# EasyEDA Pro project PCB.epro

# Board PCB1
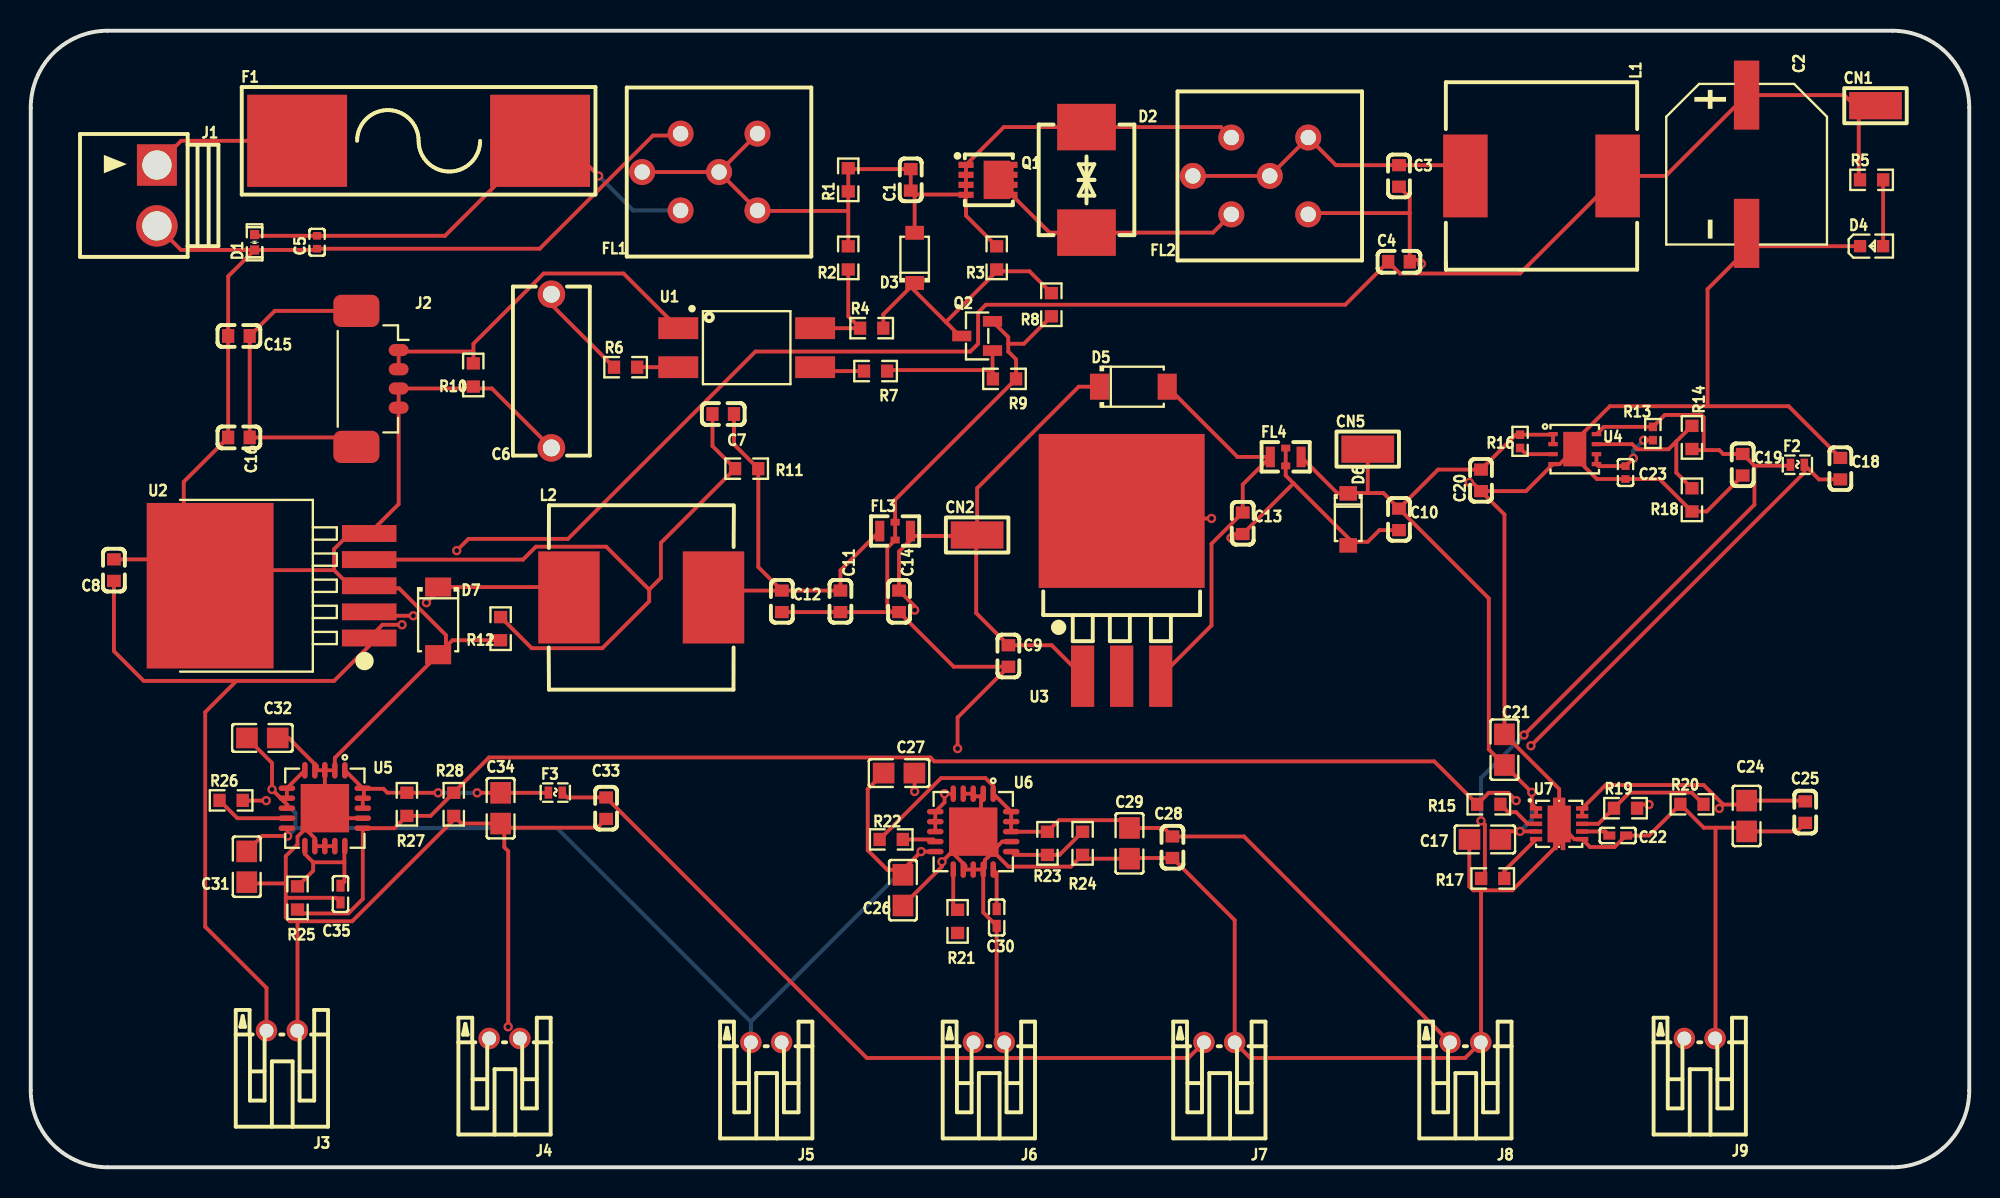
[diagram p0: board, top side]
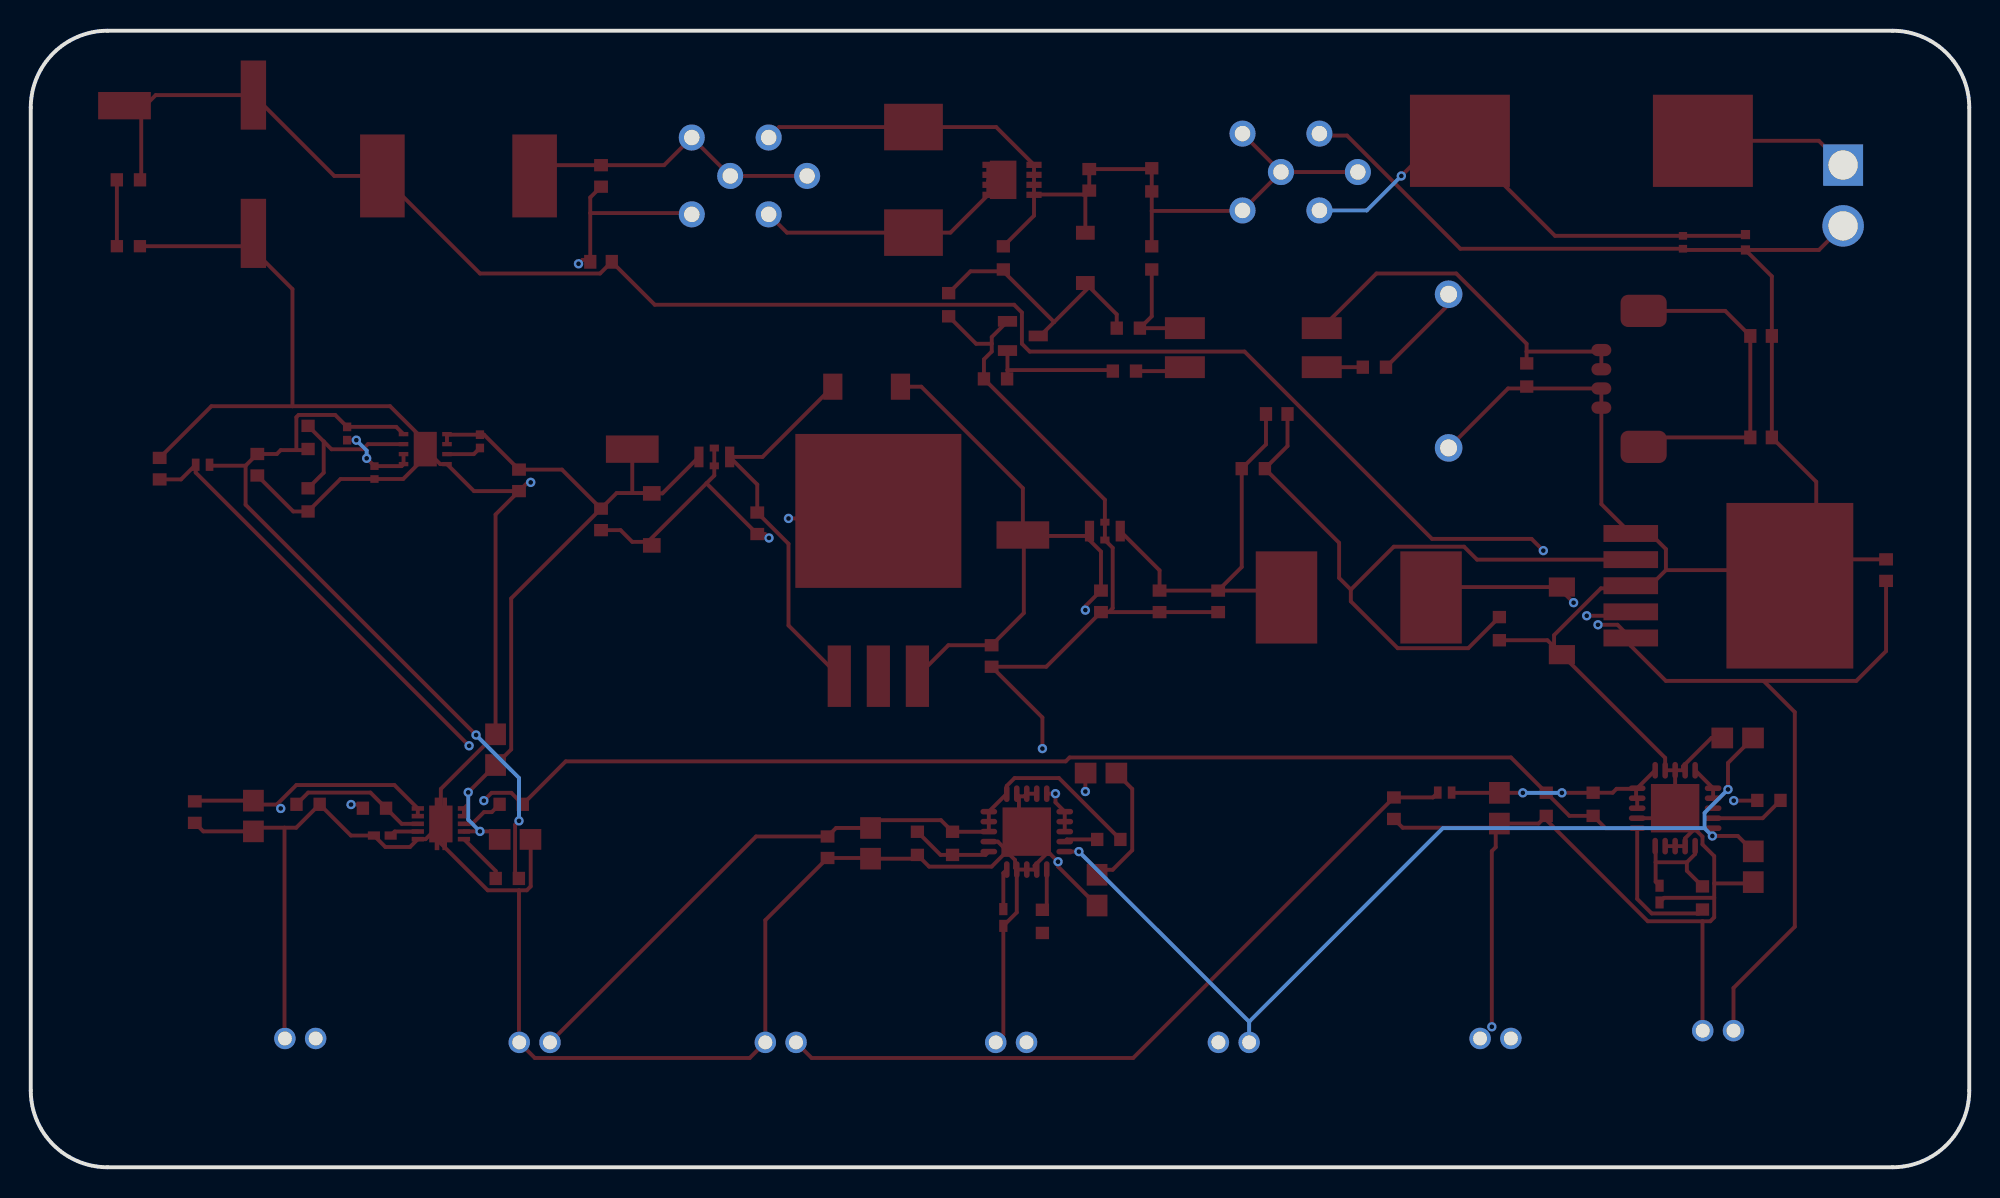
[diagram p1: board, bottom side, seen from below]

Outline 126.06 x 73.97 mm; copper layers: Top Layer, Inner1, Inner2, Bottom Layer. Coordinates in mm from the lower left corner of the outline.
Outline path: 0,68.97 arc(1.46,72.5) 5,73.97 121.06,73.97 arc(124.59,72.5) 126.06,68.97 126.06,5 arc(124.59,1.46) 121.06,0 5,0 arc(1.46,1.46) 0,5 0,68.97
Stack: Top Layer 0.035mm Outer layer thickness 1oz / Dielectric1 0.2104mm 7628 RC49% 8.6mil / Inner1 0.0152mm Inner layer thickness / Dielectric2 1.065mm 1.1mm H/HOZ Copper / Inner2 0.0152mm Inner layer thickness / Dielectric3 0.2104mm 7628 RC49% 8.6mil / Bottom Layer 0.035mm Outer layer thickness 1oz

## Design rules (mm)
template: JLCPCB Capability(Two Layers Board)
spacing copperThickness1oz (default): track to track 0.102, other pairs 0.152 to 0.3
spacing copperThickness2oz: track to track 0.203, other pairs 0.152 to 0.3
track width copperThickness1oz (default): min 0.127, default 0.254, max 2.54
track width copperThickness2oz: min 0.203, default 0.254, max 2.54
differential pair differentialPair (default): width min 0.127, default 0.254, max 2.54; gap min 0.152, default 0.152
via viaSize (default): diameter min 0.5, default 0.61, max 10; hole min 0.3, default 0.305, max 6.3

## Placement (name value [footprint] x y rotation side)
C1  1uF/50V  [C0603]  57.23 64.26 90 top
C2  330 µF/25V  [CAP-SMD_BD10.0-L10.3-W10.3-FD]  111.58 65.28 270 top
C3  10µF  [C0603]  88.98 64.52 270 top
C4  10µF  [C0603]  88.98 58.93 0 top
C5  1uF / 50V  [C0402#2]  18.62 60.2 90 top
C6  4700pF/440VAC  [CAP-TH_L11.0-W5.0-P10.00-D0.7]  33.86 51.82 90 top
C7  DNP  [C0603]  45.03 49.02 180 top
C8  10µF  [C0603]  5.41 38.86 90 top
C9  0.33µF/50V  [C0603]  63.58 33.27 270 top
C10  100uF/35V  [C0603]  88.98 42.16 270 top
C11  0.22µF/50V  [C0603]  52.65 36.83 270 top
C12  10uF/25V  [C0603]  48.84 36.83 270 top
C13  100nF  [C0603]  78.82 41.91 270 top
C14  100uF/35V  [C0603]  56.46 36.83 270 top
C15  4700pF/440VAC  [C0603]  13.54 54.1 180 top
C16  4700pF/440VAC  [C0603]  13.54 47.5 180 top
C17  22uF/16V  [C0805]  94.56 21.34 180 top
C18  4.7uF/10V  [C0603]  117.68 45.47 270 top
C19  10µF/25V  [C0603]  111.33 45.72 270 top
C20  4.7uF/10V  [C0603]  94.31 44.7 90 top
C21  22uF/16V  [C0805]  95.83 27.18 270 top
C22  DNP  [C0402]  103.2 21.59 180 top
C23  1nF/50V  [C0402#2]  103.71 45.21 90 top
C24  22uF/16V  [C0805]  111.58 22.86 90 top
C25  4.7uF  [C0603]  115.39 23.11 270 top
C26  22uF/16V  [C0805]  56.72 18.03 90 top
C27  22uF/16V  [C0805]  56.46 25.65 180 top
C28  4.7uF/10V  [C0603]  74.24 20.83 270 top
C29  22uF/16V  [C0805]  71.45 21.08 90 top
C30  0.1uF/10V  [C0402]  62.81 16.26 90 top
C31  22uF/16V  [C0805]  14.05 19.56 90 top
C32  22uF/16V  [C0805]  15.06 27.94 180 top
C33  4.7uF/10V  [C0603]  37.41 23.37 270 top
C34  22uF/16V  [C0805]  30.56 23.37 90 top
C35  0.1uF/10V  [C0402]  20.14 17.78 90 top
CN1  TP1  [CONN-SMD_5017]  119.96 69.09 0 top
CN2  TP2  [CONN-SMD_5017]  61.54 41.15 0 top
CN5  TP3  [CONN-SMD_5017]  86.94 46.74 0 top
D1  12V / 75.4 A  [D0402-BI]  14.55 60.2 90 top
D2  12V / 75.4 A  [SMC_L6.9-W5.9-LS7.9-BI]  68.66 64.26 270 top
D3  6V/10mA  [SOD-123_L2.7-W1.6-LS3.7-RD]  57.48 59.18 90 top
D4  GREEN_LED  [LED0603-RD]  119.71 59.94 0 top
D5  40V/3A  [SOD-128_L3.7-W2.5-LS4.7-RD]  71.7 50.8 0 top
D6  DNP  [SOD-123_L2.8-W1.8-LS3.7-RD]  85.67 42.16 270 top
D7  40V/3A  [SOD-128_L3.7-W2.5-LS4.7-RD]  26.49 35.56 270 top
F1  32 VAC/2A  [FUSE-SMD_L20.0-W5.2]  25.22 66.8 0 top
F2  32V/2A  [F0402]  114.88 45.72 0 top
F3  32V/2A  [F0402]  34.11 24.38 0 top
FL1  25V/15A  [FILTER-TH_6P-L12.0-W11.0_BNX016-01]  43.51 64.77 90 top
FL2  25V/15A  [FILTER-TH_6P-L12.0-W11.0_BNX016-01]  79.32 64.52 90 top
FL3  1 µF/16V  [FILTER-SMD_3P-L2.0-W1.2-L]  56.21 41.4 0 top
FL4  1 µF/16V  [FILTER-SMD_3P-L2.0-W1.2-L]  81.61 46.23 0 top
J1  2POS/10A  [CONN-TH_2P-P3.96-V]  8.2 63.25 270 top
J2  -  [antmicro-footprints:Conn_Molex_PicoBlade_1x4_0533980471]  22.17 51.31 270 top
J3  2POS/2A  [CONN-TH_S2B-PH-K-S-GW]  16.33 8.89 180 top
J4  2POS/2A  [CONN-TH_S2B-PH-K-S-GW]  30.81 8.38 180 top
J5  2POS/2A  [CONN-TH_S2B-PH-K-S-GW]  47.83 8.13 180 top
J6  2POS/2A  [CONN-TH_S2B-PH-K-S-GW]  62.3 8.13 180 top
J7  2POS/2A  [CONN-TH_S2B-PH-K-S-GW]  77.29 8.13 180 top
J8  2POS/2A  [CONN-TH_S2B-PH-K-S-GW]  93.29 8.13 180 top
J9  2POS/2A  [CONN-TH_S2B-PH-K-S-GW]  108.53 8.38 180 top
L1  22uH  [7447709220]  93.29 64.52 270 top
L2  33µH/4.2A  [IND-SMD_L12.0-W12.0-A]  39.7 37.08 0 top
Q1  30 V/35 A  [POWERPAK-1212-8_L3.0-W3.0-P0.65-LS3.3-BL]  62.3 64.26 270 top
Q2  350V/0.5A  [SOT-23-3_L2.9-W1.3-P1.90-LS2.4-BR]  61.54 54.1 0 top
R1  100kΩ  [R0603]  53.16 64.26 90 top
R2  0E  [R0603]  53.16 59.18 90 top
R3  100k  [R0603]  62.81 59.18 90 top
R4  DNP  [R0603]  54.69 54.61 0 top
R5  1K  [R0603]  119.71 64.26 0 top
R6  649E  [R0603]  38.68 52.07 0 top
R7  330E  [R0603]  54.94 51.82 180 top
R8  DNP  [R0603]  66.37 56.13 90 top
R9  10K  [R0603]  63.32 51.31 180 top
R10  DNP  [R0603]  28.78 51.56 90 top
R11  5.6K  [R0603]  46.56 45.47 0 top
R12  1.2K  [R0603]  30.56 35.05 90 top
R13  100K  [R0402]  105.48 47.75 90 top
R14  145k  [R0603]  108.02 47.5 270 top
R15  10K  [R0603]  94.82 23.62 180 top
R16  100K  [R0402]  96.85 47.24 270 top
R17  0E  [R0603]  95.07 18.8 0 top
R18  20k  [R0603]  108.02 43.43 90 top
R19  2.49K  [R0603]  103.71 23.37 0 top
R20  4.99K  [R0603]  108.02 23.62 0 top
R21  0E  [R0603]  60.27 16 270 top
R22  10K  [R0603]  55.95 21.34 180 top
R23  3.57K  [R0603]  66.11 21.08 90 top
R24  1.69K  [R0603]  68.4 21.08 90 top
R25  0E  [R0603]  17.35 17.53 270 top
R26  10K  [R0603]  13.03 23.88 0 top
R27  3.57K  [R0603]  24.46 23.62 90 top
R28  1.69K  [R0603]  27.51 23.62 90 top
U1  80V/ 50mA  [SOP-4_L6.5-W4.6-P2.54-LS10.3-TL]  46.56 53.34 0 top
U2  7V/3A  [TO-263-5_L10.4-W8.6-P1.70-LS15.3-BR]  16.84 37.85 0 top
U3  UA7805CKTTR  [TO-263-3_L10.2-W9.0-P2.54-LS15.2-TL]  70.94 37.34 90 top
U4  MCP1727T-ADJE/MF  [DFN-8_L3.0-W3.0-P0.65-BL-EP]  100.41 46.74 270 top
U5  TPS74801RGWR  [VQFN-20_L5.0-W5.0-P0.65-TL-EP]  19.12 23.37 270 top
U6  TPS74801RGWR  [VQFN-20_L5.0-W5.0-P0.65-TL-EP]  61.29 21.84 270 top
U7  TPS74801DRCR  [VSON-10_L3.0-W3.0-P0.50-TL-EP]  99.39 22.35 0 top

## Footprints (pads in the part's own frame, mm; a bottom-side part is the same pattern mirrored in y, then rotated)
7447709220
  rect 5.4x2.9 smd: 1(0,0) 2(0,9.9)
antmicro-footprints:Conn_Molex_PicoBlade_1x4_0533980471
  rrect 0.8x1.3 smd: 1(-1.875,1.75) 2(-0.625,1.75) 3(0.623,1.75) 4(1.874,1.75)
  rrect 2.1x3 smd: MP1(-4.425,-0.998) MP2(4.424,-0.998)
C0402
  rect 0.79x0.54 smd: 1(-0.545,0) 2(0.545,0)
C0402#2
  rect 0.5x0.54 smd: 1(-0.42,0) 2(0.42,0)
C0603
  rect 0.8x0.9 smd: 1(-0.7,0) 2(0.7,0)
C0805
  rect 1.41x1.35 smd: 1(-1,0) 2(1,0)
CAP-SMD_BD10.0-L10.3-W10.3-FD
  rect 4.5x1.65 smd: 1(-4.5,0) 2(4.5,0)
CAP-TH_L11.0-W5.0-P10.00-D0.7
  round 1.8 hole 1.1: 1(-5,0) 2(5,0)
CONN-SMD_5017
  rect 3.43x1.78 smd: 1(0,0)
CONN-TH_2P-P3.96-V
  rect 2.7x2.6 hole 1.9: 1(-1.98,0)
  round 2.7 hole 1.9: 2(1.98,0)
CONN-TH_S2B-PH-K-S-GW
  round 1.4 hole 0.9: 1(1,0) 2(-1,0)
D0402-BI
  rect 0.6x0.6 smd: 1(-0.5,0) 2(0.5,0)
DFN-8_L3.0-W3.0-P0.65-BL-EP
  rect 0.28x0.625 smd: 1(-0.975,-1.413) 2(-0.325,-1.413) 3(0.325,-1.413) 4(0.975,-1.413) 5(0.975,1.413) 6(0.325,1.413) 7(-0.325,1.413) 8(-0.975,1.413)
  rect 2.25x1.5 smd: 9(0,0)
F0402
  rect 0.5x0.8 smd: 1(-0.45,0) 2(0.45,0)
FILTER-SMD_3P-L2.0-W1.2-L
  rect 0.6x1.35 smd: 1(-1,0) 3(1,0)
  rect 0.6x0.45 smd: 2(0,0.58) 2(0,-0.58)
FILTER-TH_6P-L12.0-W11.0_BNX016-01
  round 1.7 hole 1: 1(-2.5,1.25) 2(2.5,1.25) 3(-2.5,-3.75) 4(0,3.75) 4(0,-1.25) 4(2.5,-3.75)
FUSE-SMD_L20.0-W5.2
  rect 6.5x6 smd: 1(-7.9,0) 2(7.9,0)
IND-SMD_L12.0-W12.0-A
  rect 4x6 smd: 1(-4.7,0) 2(4.7,0)
LED0603-RD
  rect 0.8x0.8 smd: 1(-0.749,0) 2(0.749,0)
POWERPAK-1212-8_L3.0-W3.0-P0.65-LS3.3-BL
  rect 0.406x0.991 smd: 1(-0.975,-1.486) 2(-0.325,-1.486) 3(0.325,-1.486) 4(0.975,-1.486)
  rect 0.406x0.762 smd: 5(0.975,1.486) 6(0.325,1.486) 7(-0.325,1.486) 8(-0.975,1.486)
  rect 2.5x1.727 smd: 8(0,0.52)
R0402
  rect 0.566x0.54 smd: 1(-0.433,0) 2(0.433,0)
R0603
  rect 0.806x0.864 smd: 1(-0.753,0) 2(0.753,0)
SMC_L6.9-W5.9-LS7.9-BI
  rect 3.03x3.82 smd: 1(-3.435,0) 2(3.435,0)
SOD-123_L2.7-W1.6-LS3.7-RD
  rect 0.91x1.22 smd: 1(-1.635,0) 2(1.635,0)
SOD-123_L2.8-W1.8-LS3.7-RD
  rect 0.95x1.15 smd: 1(-1.692,0) 2(1.692,0)
SOD-128_L3.7-W2.5-LS4.7-RD
  rect 1.25x1.7 smd: 1(-2.2,0) 2(2.2,0)
SOP-4_L6.5-W4.6-P2.54-LS10.3-TL
  rect 2.6x1.423 smd: 1(-4.45,1.27) 2(-4.45,-1.27) 3(4.45,-1.27) 4(4.45,1.27)
SOT-23-3_L2.9-W1.3-P1.90-LS2.4-BR
  rect 1.25x0.7 smd: 1(1,-0.95) 2(1,0.95) 3(-1,0)
TO-263-3_L10.2-W9.0-P2.54-LS15.2-TL
  rect 4x1.511 smd: 1(-5.378,2.54) 2(-5.378,0) 3(-5.378,-2.54)
  rect 10.02x10.8 smd: 4(5.378,0)
TO-263-5_L10.4-W8.6-P1.70-LS15.3-BR
  rect 3.552x1.102 smd: 1(5.173,-3.4) 2(5.173,-1.7) 3(5.173,0) 4(5.173,1.7) 5(5.173,3.4)
  rect 8.251x10.777 smd: 6(-5.173,0)
VQFN-20_L5.0-W5.0-P0.65-TL-EP
  oval 1.087x0.364 smd: 1(-2.469,1.3) 2(-2.469,0.649) 3(-2.469,-0.001) 4(-2.469,-0.65) 5(-2.469,-1.3) 11(2.469,-1.3) 12(2.469,-0.65) 13(2.469,-0.001) 14(2.469,0.649) 15(2.469,1.3)
  oval 0.364x1.087 smd: 6(-1.3,-2.469) 7(-0.65,-2.469) 8(0,-2.469) 9(0.65,-2.469) 10(1.3,-2.469) 16(1.3,2.468) 17(0.65,2.468) 18(0,2.468) 19(-0.65,2.468) 20(-1.3,2.468)
  rect 3.15x3.15 smd: 21(0,0.001)
VSON-10_L3.0-W3.0-P0.50-TL-EP
  rect 0.8x0.3 smd: 1(-1.5,1) 2(-1.5,0.5) 3(-1.5,0) 4(-1.5,-0.5) 5(-1.5,-1) 6(1.5,-1) 7(1.5,-0.5) 8(1.5,0) 9(1.5,0.5) 10(1.5,1)
  custom 1.52x3.42 smd: 11(0.002,-0.009)

## Nets
GND: C2.2 C3.2 C4.2 C5.1 C6.1 C8.2 C9.2 C11.2 C12.2 C14.2 C15.2 C16.2 C17.2 C18.1 C19.2 C20.1 C21.1 C22.1 C23.1 C24.1 C25.2 C26.1 C27.1 C28.2 C29.1 C30.1 C31.1 C32.1 C33.2 C34.1 C35.1 D1.1 D4.1 D7.2 FL1.2 FL2.3 FL3.2 J1.2 J2.3 J2.4 J3.2 J4.2 J5.2 J6.2 J7.2 J8.2 J9.2 Q2.2 R8.1 R9.1 R10.1 R12.1 R18.1 R20.1 R24.1 R28.1 U2.3 U2.5 U2.6 U4.4 U4.9 U5.2 U5.3 U5.4 U5.12 U5.13 U5.14 U5.17 U5.21 U6.2 U6.3 U6.4 U6.12 U6.13 U6.14 U6.17 U6.21 U7.6 U7.11
PGND: C6.2 R6.1
VCC_1.2: R21.2
VCC_1.2V: C24.2 C25.1 J9.1 R15.2 R19.2 R25.2 R27.1 R28.2 U5.16 U7.9 U7.10
VCC_1.8V: C28.1 C29.2 J8.1 R22.2 R23.2 U6.1 U6.18 U6.19 U6.20
VCC_2.5V: C33.1 F3.2 J7.1
VCC_3.3V: C19.1 F2.1 R13.2 R14.2 R17.1 U4.8
VCC_3V3: C18.2 F2.2 J6.1
VCC_5V: C10.1 C17.1 C20.2 C21.2 C26.2 C27.2 C31.2 C32.2 CN5.1 D6.1 FL4.3 J5.1 R16.1 U4.1 U4.2 U5.5 U5.6 U5.7 U5.8 U5.10 U6.5 U6.6 U6.7 U6.8 U6.10 U7.1 U7.2 U7.4
VCC_7V: C9.1 C14.1 CN2.1 D5.1 FL3.3 J4.1 U3.1
VCC_12V: C2.1 C4.1 C8.1 CN1.1 J3.1 L1.2 R5.1 U2.1
ISO_GND: C15.1 C16.1 J2.MP1 J2.MP2
$1N2038: F1.1 J1.1
$1N2042: C5.2 D1.2 F1.2 FL1.1
$1N3566: D2.2 FL2.1 Q1.5 Q1.6 Q1.7 Q1.8
$1N3860: C1.1 C1.2 D2.1 D3.2 FL1.3 FL1.4 FL2.2 Q1.1 Q1.2 Q1.3 Q1.4 R1.1 R1.2 R2.2 R3.2
$1N4246: R2.1 R4.1 U1.4
$1N4254: D3.1 Q2.3 R3.1 R4.2 R8.2
$1N4474: Q2.1 R7.1 R9.2
$1N4599: R7.2 U1.3
$1N4786: J2.1 J2.2 R10.2 U1.1
$1N5255: C3.1 FL2.4 L1.1
$1N6567: D4.2 R5.2
$1N7484: R6.2 U1.2
$1N22535: D7.1 L2.1 U2.2
$1N22536: C7.1 C11.1 C12.1 FL3.1 L2.2 R11.2
$1N22537: C7.2 R11.1 R12.2 U2.4
$1N24363: C10.2 C13.2 D6.2 FL4.2 U3.4
$1N24388: C13.1 D5.2 FL4.1 U3.3
$1N24953: R16.2 U4.3
$1N24955: C23.2 R13.1 U4.5 U4.6
$1N24959: R14.1 R18.2 U4.7
$1N26860: R22.1 U6.9
$1N26933: R23.1 R24.2 U6.16
$1N27469: C35.2 R25.1 U5.11 U5.15
$1N27471: R26.1 U5.9
$1N28104: R17.2 U7.5
$1N28105: C22.2 U7.7
$1N28110: R15.1 U7.3
$1N28114: R19.1 R20.2 U7.8
$1N30982: C34.2 F3.1 R26.2 R27.2 U5.1 U5.18 U5.19 U5.20
$1N43010: C30.2 U6.15
$1N43072: R21.1 U6.11

Pads without a net: U3 2

## Via types
v1: diameter 0.61, hole 0.305, Top Layer to Bottom Layer, 31 vias

## Routing (per net, layer and track width the routed paths; a pad name or vN(x,y) marks a point on that pad's centre or on a via; arc(x,y) is an arc through that point)
GND: length 530.9
  Top Layer w0.254: 109.04,49.53 102.69,49.53 100.41,47.24 U4.9 ; 109.04,49.53 114.31,49.53 C18.1 ; 109.04,49.53 109.04,57.15 111.58,59.69 111.58,59.94 ; U4.9 99.43,45.76 U4.4 97.24,44 C20.1 ; U4.9 100.41,46.23 101.84,44.79 C23.1 105.91,44.79 R18.1 108.99,42.68 C19.2 ; 61.8,21.85 61.3,21.85 U6.21 ; 61.8,21.85 61.8,24.14 ; 61.8,21.85 62.81,20.84 ; 55.95,36.13 C11.2 C12.2 ; 55.95,36.13 C14.2 60.02,32.57 C9.2 60.27,29.27 v1(60.27,27.25) ; 55.95,36.13 55.7,36.38 55.7,40.31 FL3.2 FL3.2 56.21,43.44 R9.1 64.07,52.58 63.57,53.09 63.57,53.59 ; 30.79,22.1 36.84,22.1 C33.2 ; 30.79,22.1 30.79,20.83 31.05,20.57 v1(31.05,9.14) ; 30.79,22.1 C34.1 28.01,22.37 R28.1 27.51,22.61 20.9,16.01 17.35,16.01 ; 16.59,18.47 14.13,18.47 C31.1 ; 16.59,18.47 16.59,17.53 ; 16.59,18.47 16.59,20.25 17.35,21.01 17.35,21.52 17.86,22.03 ; C3.2 89.67,63.12 89.67,62.1 ; 89.67,62.1 89.67,59.05 ; 89.67,62.1 83.16,62.1 FL2.3 ; 18.62,25.84 18.62,26.09 16.77,27.94 C32.1 ; 18.62,25.84 U5.4 ; 18.62,25.84 U5.3 ; 16.59,17.53 16.59,16.26 16.84,16.01 17.35,16.01 ; 16.59,17.53 19.84,17.53 20.14,17.23 ; 28.75,50.68 29.99,50.68 C6.1 ; 28.75,50.68 28.75,50.78 R10.1 ; 28.75,50.68 J2.3 J2.4 23.92,43.16 U2.5 20.74,41.25 19.73,40.23 19.73,38.86 ; J3.2 17.35,8.91 17.35,16.01 ; J9.2 109.56,8.41 109.56,22.1 ; R8.1 64.58,53.59 63.57,53.59 ; 27,33.87 D7.2 19.77,26.64 U5.2 U5.3 ; 27,33.87 27,34.63 23.95,37.68 22.18,37.68 U2.3 20.74,37.85 19.73,38.86 ; 27,33.87 27.43,34.3 R12.1 ; 9.95,39.56 C8.2 ; 9.95,39.56 U2.6 12.68,38.86 19.73,38.86 ; 9.95,39.56 9.95,44.61 C16.2 C15.2 12.84,57.98 D1.1 ; 62.81,20.33 62.81,20.84 ; 62.81,20.33 62.38,20.33 62.05,20 62.05,19.49 U6.14 ; 62.81,20.33 63.58,19.57 67.64,19.57 R24.1 68.65,20.08 C29.1 71.49,20.13 C28.2 78.29,16.08 J7.2 79.31,7.11 93.28,7.11 J8.2 94.31,8.15 94.31,18.02 ; 62.81,20.84 63.17,21.19 U6.17 ; D1.1 9.77,59.7 J1.2 ; D1.1 18.54,59.7 C5.1 33.09,59.78 40.46,67.14 42.13,67.14 FL1.2 ; J6.2 62.81,8.62 62.81,15.71 61.94,16.58 U6.14 ; 63.57,53.59 63.57,54.03 Q2.2 ; 89.67,59.05 90.18,59.05 v1(90.44,58.8) ; 89.67,59.05 C4.2 ; 19.05,22.72 18.55,22.72 17.86,22.03 ; 19.05,22.72 U5.17 ; 19.05,22.72 19.05,23.3 U5.21 U5.3 ; 61.8,24.14 61.46,24.14 U6.3 U6.4 ; 61.8,24.14 U6.2 ; C20.1 95.83,42.48 C21.1 99.39,24.62 U7.11 99.9,21.83 ; C20.1 93.74,44.57 v1(93.55,44.57) ; U5.14 U5.13 U5.12 18.48,21.41 17.86,22.03 ; 109.56,22.1 108.8,22.1 R20.1 105.24,21.59 103.74,21.59 103,20.84 101.4,20.84 U7.6 100.38,21.35 99.9,21.83 ; 109.56,22.1 111.34,22.1 C24.1 114.84,21.86 C25.2 ; 60.78,19.37 U6.13 U6.14 ; 60.78,19.37 60.78,19.63 60.02,20.39 59.76,20.39 v1(59.26,19.88) 59.26,19.57 C26.1 ; 60.78,19.37 U6.12 ; 111.58,59.94 C2.2 ; 111.58,59.94 D4.1 ; C17.2 93.55,21.32 93.55,18.28 93.8,18.02 94.31,18.02 ; 94.31,18.02 96.34,18.02 99.9,21.58 99.9,21.83 ; C27.1 57.48,25.64 v1(57.48,24.45)
  Inner1 w0.254: v1(57.48,24.45) v1(60.27,27.25)
  Inner2 w0.254: v1(93.55,44.57) 90.44,47.68 v1(90.44,58.8) ; 48.84,8.71 48.33,9.22 32.64,9.22 J4.2 v1(31.05,9.14) ; 48.84,8.71 48.84,8.14 J5.2 ; 48.84,8.71 48.84,9.47 v1(59.26,19.88) 59.26,21.41 57.48,23.18 v1(57.48,24.45)
PGND: length 6.4
  Top Layer w0.254: R6.1 33.86,56.14 C6.2
VCC_1.2V: length 133.9
  Top Layer w0.254: U7.9 U7.10 102.41,24.88 108.79,24.88 110.06,23.61 ; v1(105.23,23.61) 104.7,23.61 R19.2 ; 110.06,23.61 111.33,23.61 C24.2 115.35,23.86 C25.1 ; 110.06,23.61 v1(109.8,23.35) ; R25.2 17.6,16.52 20.65,16.52 21.59,17.46 U5.16 23.66,22.07 R27.1 26,22.87 R28.2 29.8,26.67 58.5,26.67 58.76,26.42 91.27,26.42 R15.2 94.81,24.37 96.09,24.37 v1(96.6,23.86)
  Inner1 w0.254: 107.52,23.35 107.52,8.4 J9.1 ; 107.52,23.35 v1(109.8,23.35) ; 107.52,23.35 105.48,23.35 v1(105.23,23.61)
  Inner2 w0.254: v1(105.23,23.61) 96.85,23.61 v1(96.6,23.86)
VCC_1.8V: length 47.6
  Top Layer w0.254: R22.2 59.19,25.33 62.08,25.33 62.59,24.82 U6.1 U6.20 U6.19 U6.18 63.77,21.84 R23.2 66.87,22.59 70.94,22.59 C29.2 73.69,22.08 C28.1 78.89,21.53 J8.1
VCC_2.5V: length 49.3
  Top Layer w0.254: J7.1 75.27,7.11 54.37,7.11 C33.1 34.88,24.07 F3.2
VCC_3.3V: length 51
  Top Layer w0.254: F2.1 114.37,45.66 112.09,45.66 ; 108.79,46.67 108.1,46.67 R14.2 ; 108.79,46.67 108.79,48.81 108.64,48.96 106.26,48.96 105.48,48.18 102.29,48.18 101.82,47.71 ; 108.79,46.67 109.8,46.67 110.06,46.42 C19.1 112.09,45.66 ; 112.09,45.66 112.09,43.12 v1(97.1,28.13) ; R17.1 94.56,19.04 94.56,22.29 v1(94.31,22.54)
  Bottom Layer w0.254: v1(94.31,22.54) 94.31,25.34 v1(97.1,28.13)
VCC_3V3: length 72.6
  Top Layer w0.254: v1(97.55,27.43) 115.33,45.21 F2.2 116.29,44.77 C18.2
  Inner2 w0.254: v1(97.55,27.43) 80.61,27.43 J6.1
VCC_5V: length 177.3
  Top Layer w0.254: 16.45,23.83 16.66,23.62 U5.8 ; 16.45,23.83 U5.7 U5.6 U5.5 ; 16.45,23.83 v1(15.69,24.59) 15.69,26.31 C32.2 ; 56.72,19.36 55.7,19.36 54.43,20.63 54.43,24.62 C27.2 ; 56.72,19.36 v1(57.9,20.54) U6.10 ; 56.72,19.36 C26.2 ; U4.2 98.99,47.71 98.96,47.68 96.58,47.68 C20.2 91.52,45.4 C10.1 ; C17.1 96.09,21.86 v1(96.85,21.86) 97.88,21.86 U7.4 ; U7.2 U7.1 97.61,23.63 v1(97.61,24.4) C21.2 94.82,27.19 94.82,37.02 C10.1 ; C10.1 87.96,43.88 86.94,43.88 ; U5.10 16.7,22.02 v1(16.7,21.56) 15.05,21.56 C31.2 ; 86.94,43.88 85.7,43.88 D6.1 84.98,43.86 FL4.3 ; 86.94,43.88 CN5.1 ; U6.5 v1(59.42,24.31) 59.42,23.75 U6.6 U6.7 U6.8
  Inner1 w0.254: v1(97.61,24.4) 97.36,24.65 60.53,24.65 60.19,24.31 v1(59.42,24.31) 59.42,22.28 57.9,20.76 v1(57.9,20.54)
  Bottom Layer w0.254: 46.83,9.47 J5.1 ; 46.83,9.47 v1(57.9,20.54) ; 46.83,9.47 34.23,22.07 17.21,22.07 ; 17.21,22.07 v1(16.7,21.56) ; 17.21,22.07 17.21,23.07 v1(15.69,24.59) ; v1(96.85,21.86) 97.61,22.62 v1(97.61,24.4)
VCC_7V: length 77.1
  Top Layer w0.254: 57.23,41.09 57.23,41.39 FL3.3 ; 57.23,41.09 57.23,40.83 56.46,40.07 C14.1 57.48,36.51 v1(57.48,36.26) ; 57.23,41.09 61.48,41.09 ; 61.48,41.09 CN2.1 61.54,44.2 68.15,50.8 D5.1 ; 61.48,41.09 61.48,36.07 C9.1 66.39,33.97 U3.1
  Inner2 w0.254: v1(57.48,36.26) 57.23,36.26 29.81,8.84 J4.1
VCC_12V: length 169
  Top Layer w0.254: 13.38,31.65 19.73,31.65 22.01,33.94 U2.1 22.87,35.31 v1(24.14,35.31) ; 13.38,31.65 11.34,29.62 11.34,15.66 15.33,11.67 J3.1 ; 13.38,31.65 7.35,31.65 5.41,33.59 C8.1 ; 118.88,69.09 118.62,69.09 117.93,69.78 C2.1 106.32,64.52 L1.2 96.84,58.17 89.04,58.17 C4.1 85.48,56.13 62.11,56.13 61.61,55.63 61.61,53.59 61.1,53.09 47.13,53.09 34.94,40.89 28.46,40.89 v1(27.7,40.13) ; 118.88,69.09 118.88,64.34 R5.1 ; 118.88,69.09 CN1.1
  Inner1 w0.254: v1(24.14,35.31) 24.14,36.58 v1(27.7,40.13)
ISO_GND: length 21.4
  Top Layer w0.254: J2.MP1 15.87,55.73 C15.1 C16.1 20.56,47.5 J2.MP2
$1N2038: length 9.8
  Top Layer w0.254: J1.1 9.78,66.8 F1.1
$1N2042: length 32.2
  Top Layer w0.254: D1.2 14.63,60.62 C5.2 26.94,60.62 F1.2 34.65,66.8 v1(36.93,64.52)
  Bottom Layer w0.254: FL1.1 39.18,62.27 v1(36.93,64.52)
$1N3566: length 18.7
  Top Layer w0.254: FL2.1 76.88,60.83 66.25,60.83 Q1.5 Q1.6 63.79,64.19 ; Q1.8 62.9,64.19 63.79,64.19 ; 63.79,64.19 Q1.7 Q1.8
$1N3860: length 59.4
  Top Layer w0.254: 57.48,63.31 C1.1 C1.2 53.21,64.96 R1.2 R1.1 53.16,62.24 ; 57.48,63.31 60.8,63.31 Q1.4 ; 57.48,63.31 D3.2 ; Q1.4 60.82,61.93 R3.2 ; Q1.4 Q1.3 Q1.2 Q1.1 63.28,67.7 D2.1 77.39,67.7 FL2.2 ; 53.16,62.24 47.29,62.24 FL1.3 FL1.4 ; 53.16,62.24 R2.2 ; FL1.4 FL1.4 ; FL1.4 FL1.4
$1N4246: length 7.1
  Top Layer w0.254: R2.1 53.16,55.38 R4.1 U1.4
$1N4254: length 17.4
  Top Layer w0.254: 62.81,58.31 64.95,58.31 R8.2 ; 62.81,58.31 R3.1 ; 62.81,58.31 59.51,55.01 ; 57.23,57.29 59.51,55.01 ; 57.23,57.29 57.48,57.55 ; 57.23,57.29 55.44,55.51 R4.2 ; 59.51,55.01 60.42,54.1 Q2.3
$1N4474: length 8.7
  Top Layer w0.254: 62.54,51.88 55.76,51.88 R7.1 ; 62.54,51.88 62.54,51.33 R9.2 ; 62.54,51.88 Q2.1
$1N4599: length 3.3
  Top Layer w0.254: R7.2 51.26,51.82 U1.3
$1N4786: length 24.1
  Top Layer w0.254: 28.79,53.09 28.79,53.59 33.36,58.17 38.55,58.17 U1.1 ; 28.79,53.09 28.79,52.32 R10.2 ; 28.79,53.09 24.02,53.09 J2.1 J2.2
$1N5255: length 19.8
  Top Layer w0.254: L1.1 92.59,65.22 C3.1 84.87,65.22 FL2.4 FL2.4 FL2.4
$1N6567: length 4.3
  Top Layer w0.254: D4.2 120.46,64.26
$1N7484: length 2.7
  Top Layer w0.254: U1.2 R6.2
$1N22535: length 14.3
  Top Layer w0.254: U2.2 22.27,35.89 v1(24.88,35.89) ; v1(25.73,36.74) 26.49,37.51 D7.1 34.32,37.76 L2.1
  Inner2 w0.254: v1(25.73,36.74) v1(24.88,35.89)
$1N22536: length 26.1
  Top Layer w0.254: C12.1 44.84,37.53 L2.2 ; C12.1 47.31,39.06 R11.2 45.73,47.04 C7.1 ; C12.1 C11.1 52.65,38.85 FL3.1
$1N22537: length 46.6
  Top Layer w0.254: 40.22,37.59 40.98,38.35 40.98,40.64 R11.1 44.33,46.94 C7.2 ; 40.22,37.59 40.22,36.83 37.17,33.78 32.58,33.78 R12.2 ; 40.22,37.59 37.42,40.39 32.85,40.39 32.01,39.55 U2.4
$1N24363: length 25
  Top Layer w0.254: 85.93,40.7 82.12,44.51 ; 85.93,40.7 D6.2 ; 85.93,40.7 86.94,40.7 87.7,41.46 C10.2 ; 82.12,44.51 C13.2 78.31,41.21 v1(78.05,40.96) ; 82.12,44.51 81.61,45.02 FL4.2 FL4.2 ; v1(76.78,42.23) 71.43,42.23 U3.4
  Inner1 w0.254: v1(78.05,40.96) v1(76.78,42.23)
$1N24388: length 25.8
  Top Layer w0.254: U3.3 76.78,35.26 76.78,40.58 C13.1 78.82,44.43 FL4.1 78.48,46.23 D5.2
$1N24953: length 2.3
  Top Layer w0.254: U4.3 97.25,46.41 R16.2
$1N24955: length 5.4
  Top Layer w0.254: v1(104.89,47.32) R13.1 ; v1(104.21,46.14) C23.2 101.95,45.63 U4.5 U4.6
  Bottom Layer w0.254: v1(104.21,46.14) 104.21,46.65 v1(104.89,47.32)
$1N24959: length 10.4
  Top Layer w0.254: R18.2 107.01,45.2 107.01,47.24 ; R14.1 107.01,47.24 ; 107.01,47.24 106.5,46.73 104.47,46.73 104.14,47.06 U4.7
$1N26860: length 2.2
  Top Layer w0.254: R22.1 58.68,21.34 U6.9
$1N26933: length 5.4
  Top Layer w0.254: U6.16 63.97,20.33 R23.1 66.89,20.33 R24.2
$1N27469: length 8
  Top Layer w0.254: U5.15 20.4,20.87 20.4,19.85 ; R25.1 18.36,19.3 18.36,19.85 ; 18.36,19.85 17.83,20.39 U5.11 ; 18.36,19.85 20.4,19.85 ; 20.4,19.85 20.4,18.58 C35.2
$1N27471: length 4.9
  Top Layer w0.254: U5.9 13.43,22.72 R26.1
$1N28104: length 3.4
  Top Layer w0.254: R17.2 95.82,19.29 U7.5
$1N28105: length 1.9
  Top Layer w0.254: C22.2 102.39,21.85 U7.7
$1N28110: length 2.8
  Top Layer w0.254: R15.1 96.08,23.11 96.59,23.11 97.35,22.35 U7.3
$1N28114: length 9
  Top Layer w0.254: U7.8 101.94,22.35 R19.1 103.97,24.38 108.02,24.38 R20.2
$1N30982: length 28.1
  Top Layer w0.254: 21.67,24.63 U5.20 U5.1 ; 21.67,24.63 22.94,24.63 23.19,24.38 R27.2 24.47,24.37 v1(26.49,24.37) ; 21.67,24.63 21.67,24.09 U5.19 U5.18 ; v1(15.31,23.86) 13.8,23.86 R26.2 ; v1(29.03,24.37) C34.2 33.65,24.37 F3.1
  Inner2 w0.254: v1(26.49,24.37) 25.98,23.86 v1(15.31,23.86)
  Bottom Layer w0.254: v1(29.03,24.37) v1(26.49,24.37)
$1N43010: length 2.7
  Top Layer w0.254: C30.2 62.81,19.15 U6.15
$1N43072: length 2.7
  Top Layer w0.254: U6.11 59.99,17.04 R21.1
